# Altium project MezzanineDCDC.PrjPcb
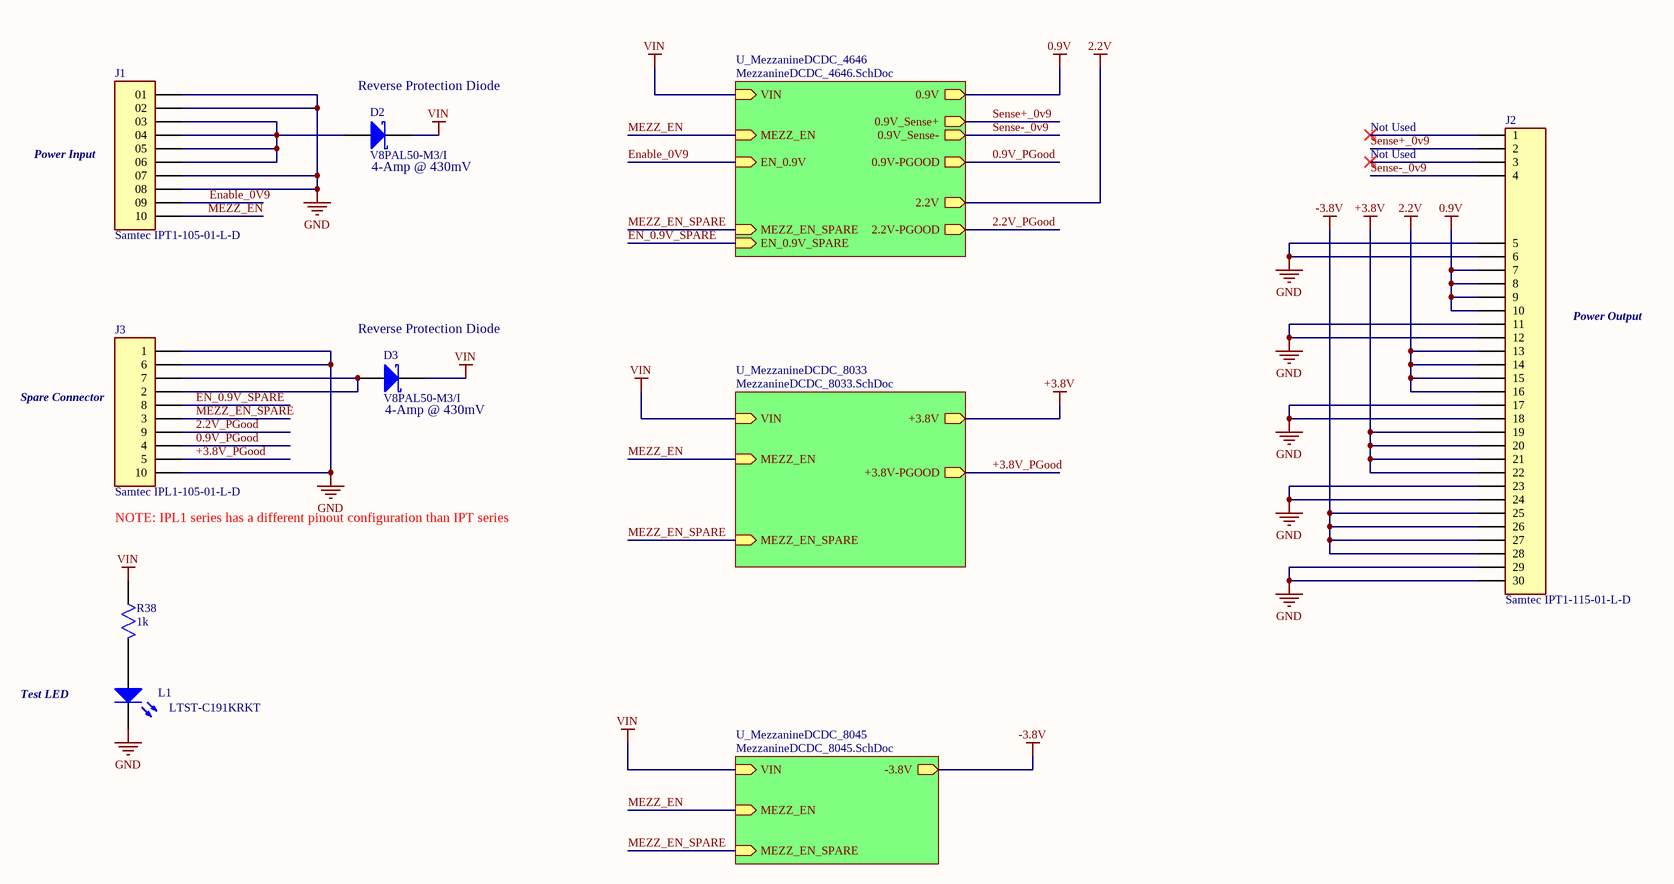
[diagram p0: MezzanineDCDC_Overall.SchDoc]
4 sheets, 95 parts. Net scope: hierarchical (ports join the sheet entries above them; power ports are global).
Board file: MezzanineDCDC_R1.PcbDoc
Sheets:
  MezzanineDCDC_Overall.SchDoc
    U_MezzanineDCDC_8033 = MezzanineDCDC_8033.SchDoc
    U_MezzanineDCDC_8045 = MezzanineDCDC_8045.SchDoc
    U_MezzanineDCDC_4646 = MezzanineDCDC_4646.SchDoc

## Sheet MezzanineDCDC_Overall.SchDoc: Mezzanine DCDC PCB Overall
size B; Date: 9/7/2021; Engineer: J. Juneau; DocumentNumber: 1006; Revision: 1.2; SheetNumber: 1; SheetTotal: 4

### Parts
D2  V8PAL50-M3/I  [Schottky Diode V8PAL50-M3/I]
D3  V8PAL50-M3/I  [Schottky Diode V8PAL50-M3/I]
J1  Samtec IPT1-105-01-L-D  [SAMTEC_IPT1-105-01-L-D]
J2  Samtec IPT1-115-01-L-D  [IPT1-115-01-L-D]
J3  Samtec IPL1-105-01-L-D  [IPL1-105-01-L-D]
L1  LTST-C191KRKT  [LED]
R38  value 1k  [Resistor ERJ2G/CRCW 0402]  (hidden comment: ERJ-2GEJ102X)

### Sub-sheets
U_MezzanineDCDC_4646 = MezzanineDCDC_4646.SchDoc: 0.9V (out), VIN (in), 2.2V-PGOOD (out), 2.2V (out), MEZZ_EN (in), EN_0.9V (in), 0.9V_Sense+ (out), 0.9V-PGOOD (out), 0.9V_Sense- (out), MEZZ_EN_SPARE (in), EN_0.9V_SPARE (in)
U_MezzanineDCDC_8033 = MezzanineDCDC_8033.SchDoc: MEZZ_EN (in), VIN (in), +3.8V-PGOOD (out), +3.8V (out), MEZZ_EN_SPARE (in)
U_MezzanineDCDC_8045 = MezzanineDCDC_8045.SchDoc: -3.8V (out), VIN (in), MEZZ_EN (in), MEZZ_EN_SPARE (in)

### Nets
0.9V: J2.7 J2.8 J2.9 J2.10 ; sheet U_MezzanineDCDC_4646/0.9V
2.2V: J2.13 J2.14 J2.15 J2.16 ; sheet U_MezzanineDCDC_4646/2.2V
+3.8V: J2.19 J2.20 J2.21 J2.22 ; sheet U_MezzanineDCDC_8033/+3.8V
-3.8V: J2.25 J2.26 J2.27 J2.28 ; sheet U_MezzanineDCDC_8045/-3.8V
GND: J1.01 J1.02 J1.07 J1.08 J2.5 J2.6 J2.11 J2.12 J2.17 J2.18 J2.23 J2.24 J2.29 J2.30 J3.1 J3.6 J3.10 L1.2(K)
VIN: D2.1(K) D3.1(K) R38.1 ; sheet U_MezzanineDCDC_8033/VIN, sheet U_MezzanineDCDC_8045/VIN, sheet U_MezzanineDCDC_4646/VIN
0.9V_PGood: J3.4 ; sheet U_MezzanineDCDC_4646/0.9V-PGOOD
2.2V_PGood: J3.9 ; sheet U_MezzanineDCDC_4646/2.2V-PGOOD
+3.8V_PGood: J3.5 ; sheet U_MezzanineDCDC_8033/+3.8V-PGOOD
EN_0.9V_SPARE: J3.8 ; sheet U_MezzanineDCDC_4646/EN_0.9V_SPARE
Enable_0V9: J1.09 ; sheet U_MezzanineDCDC_4646/EN_0.9V
MEZZ_EN: J1.10 ; sheet U_MezzanineDCDC_8033/MEZZ_EN, sheet U_MezzanineDCDC_8045/MEZZ_EN, sheet U_MezzanineDCDC_4646/MEZZ_EN
MEZZ_EN_SPARE: J3.3 ; sheet U_MezzanineDCDC_8033/MEZZ_EN_SPARE, sheet U_MezzanineDCDC_8045/MEZZ_EN_SPARE, sheet U_MezzanineDCDC_4646/MEZZ_EN_SPARE
Sense+_0v9: J2.2 ; sheet U_MezzanineDCDC_4646/0.9V_Sense+
Sense-_0v9: J2.4 ; sheet U_MezzanineDCDC_4646/0.9V_Sense-
NetD2_2: D2.2(A) J1.03 J1.04 J1.05 J1.06
NetD3_2: D3.2(A) J3.2 J3.7
NetL1_1: L1.1(A) R38.2

Not connected (* = marked no-connect by the designer): J2 1* 3*

### Notes on the sheet
- (near D2) Reverse Protection Diode
- Power Input
- (near D2) 4-Amp @ 430mV
- Not Used
- Power Output
- (near D3) Reverse Protection Diode
- (near J3) Spare Connector
- (near D3) 4-Amp @ 430mV
- (near J3) NOTE: IPL1 series has a different pinout configuration than IPT series
- Test LED
- Revision Notes:
- Title
- Size:
- Date:
- B
- Engineer:
- Number:
- Revision:
- Sheet
- of
- Electronics Development Group
- LSU Physics and Astronomy
- 133 Nicholson Hall
- Baton Rouge, LA 70803
- File:

### Library data of the parts
D2 D3 = Schotkky Diode: Diode Schottky 50V 4A Surface Mount DO-221BC (SMPA); ComponentLink1Description: Digikey; ComponentLink1URL: https://www.digikey.com/en/products/detail/vishay-general-semiconductor-diodes-division/V8PAL50-M3-I/4580781
J1 = Samtec IPT1-105-01-L-D: CONN HEADER VERT 10POS 2.54MM; ComponentLink1Description: Digikey; ComponentLink1URL: https://www.digikey.com/en/products/detail/samtec-inc/IPT1-105-01-L-D/6561590
J2 = Samtec IPT1-115-01-L-D: 15x2 Pin Connector CONN HEADER VERT 30POS 2.54MM; ComponentLink1Description: Digikey; ComponentLink1URL: https://www.digikey.com/en/products/detail/samtec-inc/IPT1-115-01-L-D/6693479
J3 = Samtec IPL1-105-01-L-D: 5x2 Pin connector; ComponentLink1Description: Samtec; ComponentLink1URL: https://www.samtec.com/products/ipl1
L1 = LED: Red 631nm LED Indication - Discrete 2V 0603 (1608 Metric); ComponentLink1Description: Digikey; ComponentLink1URL: https://www.digikey.com/en/products/detail/lite-on-inc/LTST-C191KRKT/386837?s=N4IgTCBcDaIDIBUDKCC0BhAjATkwaQCU8EQBdAXyA
R38 = ERJ2G Resistor 0402: RES SMD 1K OHM 5% 1/10W 0402; ComponentLink1Description: Digikey; ComponentLink1URL: https://www.digikey.com/en/products/detail/panasonic-electronic-components/ERJ-2GEJ102X/146898?s=N4IgTCBcDaIKICUBSBaMBxOSCMAGMAGiALoC%2BQA

## Sheet MezzanineDCDC_8033.SchDoc: Mezzanine DCDC PCB - LTM8033
size B; Date: 9/7/2021; Engineer: J. Juneau; DocumentNumber: 1006; Revision: 1.2; SheetNumber: 3; SheetTotal: 4
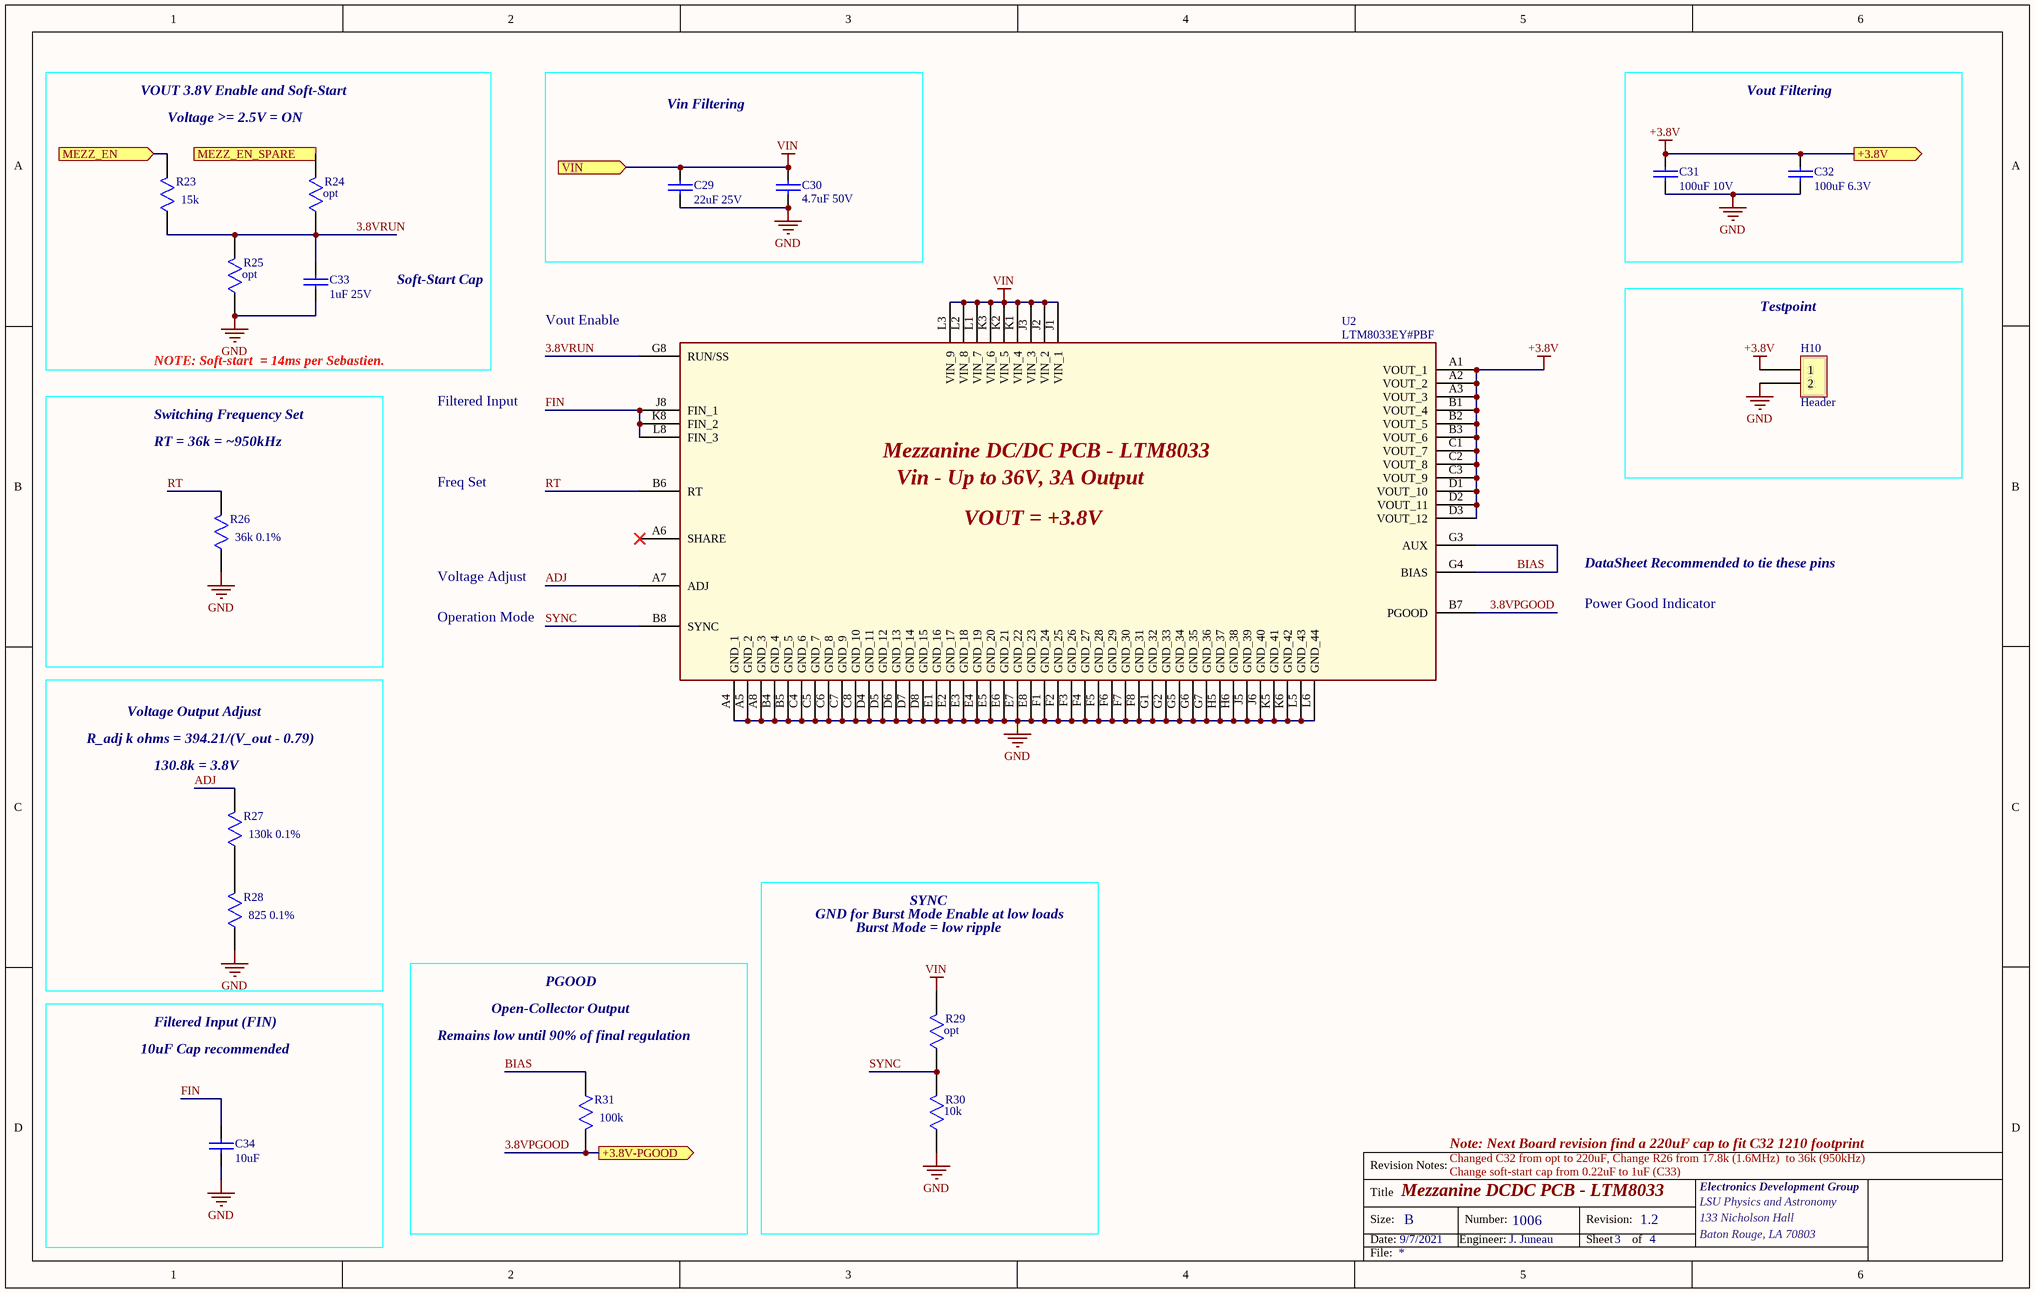
[diagram p1: MezzanineDCDC_8033.SchDoc]

### Parts
C29  value 22uF 25V  [CAP 1210 Murata]  (hidden comment: GRM32ER61E226KE15L)
C30  value 4.7uF 50V  [CAP 1206 TDK]  (hidden comment: UMK316BJ475KL-T)
C31  value 100uF 10V  [CAP 1210 Murata]  (hidden comment: LMK325BJ107MM-T)
C32  value 100uF 6.3V  [CAP 1210 Murata]  (hidden comment: GRM31CR60J227ME11L)
C33  value 1uF 25V  [Cap 0603 TDK]  (hidden comment: 06033C105KAT4A)
C34  value 10uF  [CAP 1210 Murata]  (hidden comment: GRM32ER71H106KA12L)
H10  Header  [Header 2Pin]
R23  value 15k  [Resistor ERJ2G/CRCW 0402]  (hidden comment: ERJ-U02F1502X)
R24  opt  [Resistor ERJ2G/CRCW 0402]
R25  opt  [Resistor ERJ2G/CRCW 0402]
R26  value 36k 0.1%  [Resistor 0603 - ERJ]  (hidden comment: ERA-3APB363V)
R27  value 130k 0.1%  [Resistor 0603 - ERJ]  (hidden comment: ERA-3AEB134V)
R28  value 825 0.1%  [Resistor 0603 - ERJ]  (hidden comment: ERA-3AEB8250V)
R29  opt  [Resistor ERJ2G/CRCW 0402]
R30  value 10k  [Resistor ERJ2G/CRCW 0402]  (hidden comment: ERJ-2GEJ103X)
R31  value 100k  [Resistor ERJ2G/CRCW 0402]  (hidden comment: ERJ-2RKF1003X)
U2  LTM8033EY#PBF  [LTM8033 BGA]

### Blocks framed on the sheet
Vin Filtering: C29 C30
Vout Filtering: C31 C32
Testpoint: H10

### Ports
+3.8V (out), +3.8V-PGOOD (out), MEZZ_EN (in), MEZZ_EN_SPARE (in), VIN (in)

### Nets
+3.8V: C31.1 C32.1 H10.1 U2.A1(VOUT_1) U2.A2(VOUT_2) U2.A3(VOUT_3) U2.B1(VOUT_4) U2.B2(VOUT_5) U2.B3(VOUT_6) U2.C1(VOUT_7) U2.C2(VOUT_8) U2.C3(VOUT_9) U2.D1(VOUT_10) U2.D2(VOUT_11) U2.D3(VOUT_12) ; port +3.8V
GND: C29.2 C30.2 C31.2 C32.2 C33.2 C34.2 H10.2 R25.1 R26.1 R28.1 R30.1 U2.A4(GND_1) U2.A5(GND_2) U2.A8(GND_3) U2.B4(GND_4) U2.B5(GND_5) U2.C4(GND_6) U2.C5(GND_7) U2.C6(GND_8) U2.C7(GND_9) U2.C8(GND_10) U2.D4(GND_11) U2.D5(GND_12) U2.D6(GND_13) U2.D7(GND_14) U2.D8(GND_15) U2.E1(GND_16) U2.E2(GND_17) U2.E3(GND_18) U2.E4(GND_19) U2.E5(GND_20) U2.E6(GND_21) U2.E7(GND_22) U2.E8(GND_23) U2.F1(GND_24) U2.F2(GND_25) U2.F3(GND_26) U2.F4(GND_27) U2.F5(GND_28) U2.F6(GND_29) U2.F7(GND_30) U2.F8(GND_31) U2.G1(GND_32) U2.G2(GND_33) U2.G5(GND_34) U2.G6(GND_35) U2.G7(GND_36) U2.H5(GND_37) U2.H6(GND_38) U2.J5(GND_39) U2.J6(GND_40) U2.K5(GND_41) U2.K6(GND_42) U2.L5(GND_43) U2.L6(GND_44)
VIN: C29.1 C30.1 R29.2 U2.J1(VIN_1) U2.J2(VIN_2) U2.J3(VIN_3) U2.K1(VIN_4) U2.K2(VIN_5) U2.K3(VIN_6) U2.L1(VIN_7) U2.L2(VIN_8) U2.L3(VIN_9) ; port VIN
3.8VPGOOD: R31.2 U2.B7(PGOOD) ; port +3.8V-PGOOD  [project net +3.8V_PGood]
3.8VRUN: C33.1 R23.1 R24.1 R25.2 U2.G8(RUN/SS)
ADJ: R27.2 U2.A7(ADJ)
BIAS: R31.1 U2.G3(AUX) U2.G4(BIAS)
FIN: C34.1 U2.J8(FIN_1) U2.K8(FIN_2) U2.L8(FIN_3)
MEZZ_EN: R23.2 ; port MEZZ_EN
MEZZ_EN_SPARE: R24.2 ; port MEZZ_EN_SPARE
RT: R26.2 U2.B6(RT)
SYNC: R29.1 R30.2 U2.B8(SYNC)
NetR27_1: R27.1 R28.2

Not connected (* = marked no-connect by the designer): U2 A6(SHARE)*

### Notes on the sheet
- VOUT 3.8V Enable and Soft-Start
- Voltage >= 2.5V = ON
- Soft-Start Cap
- NOTE: Soft-start  = 14ms per Sebastien.
- Vout Enable
- Switching Frequency Set
- Filtered Input
- RT = 36k = ~950kHz
- Freq Set
- (near U2) Mezzanine DC/DC PCB - LTM8033
- (near U2) Vin - Up to 36V, 3A Output
- (near U2) VOUT = +3.8V
- DataSheet Recommended to tie these pins
- Voltage Adjust
- Operation Mode
- Power Good Indicator
- R_adj k ohms = 394.21/(V_out - 0.79)
- Voltage Output Adjust
- (near R27) 130.8k = 3.8V
- SYNC
- GND for Burst Mode Enable at low loads
- Burst Mode = low ripple
- Filtered Input (FIN)
- (near R31) Remains low until 90% of final regulation
- Open-Collector Output
- PGOOD
- 10uF Cap recommended
- Changed C32 from opt to 220uF, Change R26 from 17.8k (1.6MHz)  to 36k (950kHz)
- Note: Next Board revision find a 220uF cap to fit C32 1210 footprint
- Change soft-start cap from 0.22uF to 1uF (C33)
- Revision Notes:
- Title
- Size:
- Date:
- B
- Engineer:
- Number:
- Revision:
- Sheet
- of
- Electronics Development Group
- LSU Physics and Astronomy
- 133 Nicholson Hall
- Baton Rouge, LA 70803
- File:

### Library data of the parts
C29 = Capacitor 1210: 22µF ±10% 25V Ceramic Capacitor X5R 1210 (3225 Metric); ComponentLink1Description: Digikey; ComponentLink1URL: https://www.digikey.com/en/products/detail/murata-electronics/GRM32ER61E226KE15L/965903?s=N4IgTCBcDaIOICUCyBmMBRBA2AjOsYWA0ujgKwAyIAugL5A
C30 = Capacitor 1206: 4.7µF ±10% 50V Ceramic Capacitor X5R 1206 (3216 Metric); Dimensions: 3.2x1.6x1.8mm; ComponentLink1Description: Digikey; ComponentLink1URL: https://www.digikey.com/en/products/detail/taiyo-yuden/UMK316BJ475KL-T/1646591?s=N4IgTCBcDaIKoFkDSBmAjANgEICkAsA7AKxIAyAtACogC6AvkA
C31 = Capacitor 1210: CAP CER 100UF 10V X5R 1210; ComponentLink1Description: Digikey; ComponentLink1URL: https://www.digikey.com/en/products/detail/taiyo-yuden/LMK325BJ107MM-T/1646594?s=N4IgTCBcDaIDIFkDSBmMBWAQgKQIwAYB2BBAWgBUQBdAXyA
C32 = Capacitor 1210: 220 µF ±20% 6.3V Ceramic Capacitor X5R 1206 (3216 Metric); ComponentLink1Description: Digikey; ComponentLink1URL: https://www.digikey.com/en/products/detail/murata-electronics/GRM31CR60J227ME11L/6155740
C33 = Capacitor 0603 TDK: 1 µF ±10% 25V Ceramic Capacitor X7R 0603 (1608 Metric); ComponentLink1Description: Digikey; ComponentLink1URL: https://www.digikey.com/en/products/detail/avx-corporation/06033C105KAT4A/8107677?s=N4IgTCBcDaIAwDY4GZkGMCMcCsBrAhgC4As%2BIAugL5A
C34 = Capacitor 1210: CAP CER 10UF 50V X7R 1210; ComponentLink1Description: Digikey; ComponentLink1URL: https://www.digikey.com/en/products/detail/murata-electronics/GRM32ER71H106KA12L/2548481?s=N4IgTCBcDaIOICUCyBmMBRBB2AjACRwAYA2AaQEEcwAZEAXQF8g
H10 = Header - 2Pin: Connector Header Through Hole 2 position 0.100" (2.54mm); ComponentLink1Description: Digikey; ComponentLink1URL: https://www.digikey.com/en/products/detail/amphenol-icc-fci/68001-202HLF/2023308
R23 = ERJ2G Resistor 0402: RES 15K OHM 1% 1/10W 0402 SMD; ComponentLink1Description: Digikey; ComponentLink1URL: https://www.digikey.com/en/products/detail/panasonic-electronic-components/ERJ-U02F1502X/11630567?s=N4IgTCBcDaIKICUBSBaAqgBjAMQIwFYsANEAXQF8g
R24 R25 R29 = ERJ2G Resistor 0402: Resistor 0402; Value: opt
R26 = Resistor 0603: 36 kOhms ±0.1% 0.1W, 1/10W Chip Resistor 0603 (1608 Metric) Automotive AEC-Q200 Thin Film; ComponentLink1Description: Digikey; ComponentLink1URL: https://www.digikey.com/en/products/detail/panasonic-electronic-components/ERA-3APB363V/3070649?s=N4IgTCBcDaIKICUCCBaAzAQwA4CM0DY0A3EAXQF8g
R27 = Resistor 0603: RES SMD 130K OHM 0.1% 1/10W 0603; ComponentLink1Description: Digikey; ComponentLink1URL: https://www.digikey.com/en/products/detail/panasonic-electronic-components/ERA-3AEB134V/1465905?s=N4IgTCBcDaIKICUCCBaAzEuAhAjGgLAGogC6AvkA
R28 = Resistor 0603: RES SMD 825 OHM 0.1% 1/10W 0603; ComponentLink1Description: Digikey; ComponentLink1URL: https://www.digikey.com/en/products/detail/panasonic-electronic-components/ERA-3AEB8250V/2026741?s=N4IgTCBcDaIKICUCCBaAzEuAhAHGArAAwBqIAugL5A
R30 = ERJ2G Resistor 0402: RES SMD 10K OHM 5% 1/10W 0402; ComponentLink1Description: Digikey; ComponentLink1URL: https://www.digikey.com/en/products/detail/panasonic-electronic-components/ERJ-2GEJ103X/146735?s=N4IgTCBcDaIKICUBSBaMBxOSCMAGAzABogC6AvkA
R31 = ERJ2G Resistor 0402: RES SMD 100K OHM 1% 1/10W 0402; ComponentLink1Description: Digikey; ComponentLink1URL: https://www.digikey.com/en/products/detail/panasonic-electronic-components/ERJ-2RKF1003X/192081?s=N4IgTCBcDaIKICUBSBaMCDSAxAjABjwGYANEAXQF8g
U2 = LTM8033: Non-Isolated PoL Module DC DC Converter Output 0.8 ~ 24V - - 3A 3.6V - 36V Input; ComponentLink1Description: Digikey; ComponentLink1URL: https://www.digikey.com/en/products/detail/analog-devices-inc/LTM8033EY-PBF/4964717

## Sheet MezzanineDCDC_8045.SchDoc: Mezzanine DCDC PCB - LTM8045
size B; Date: 9/7/2021; Engineer: J. Juneau; DocumentNumber: 1006; Revision: 1.2; SheetNumber: 4; SheetTotal: 4
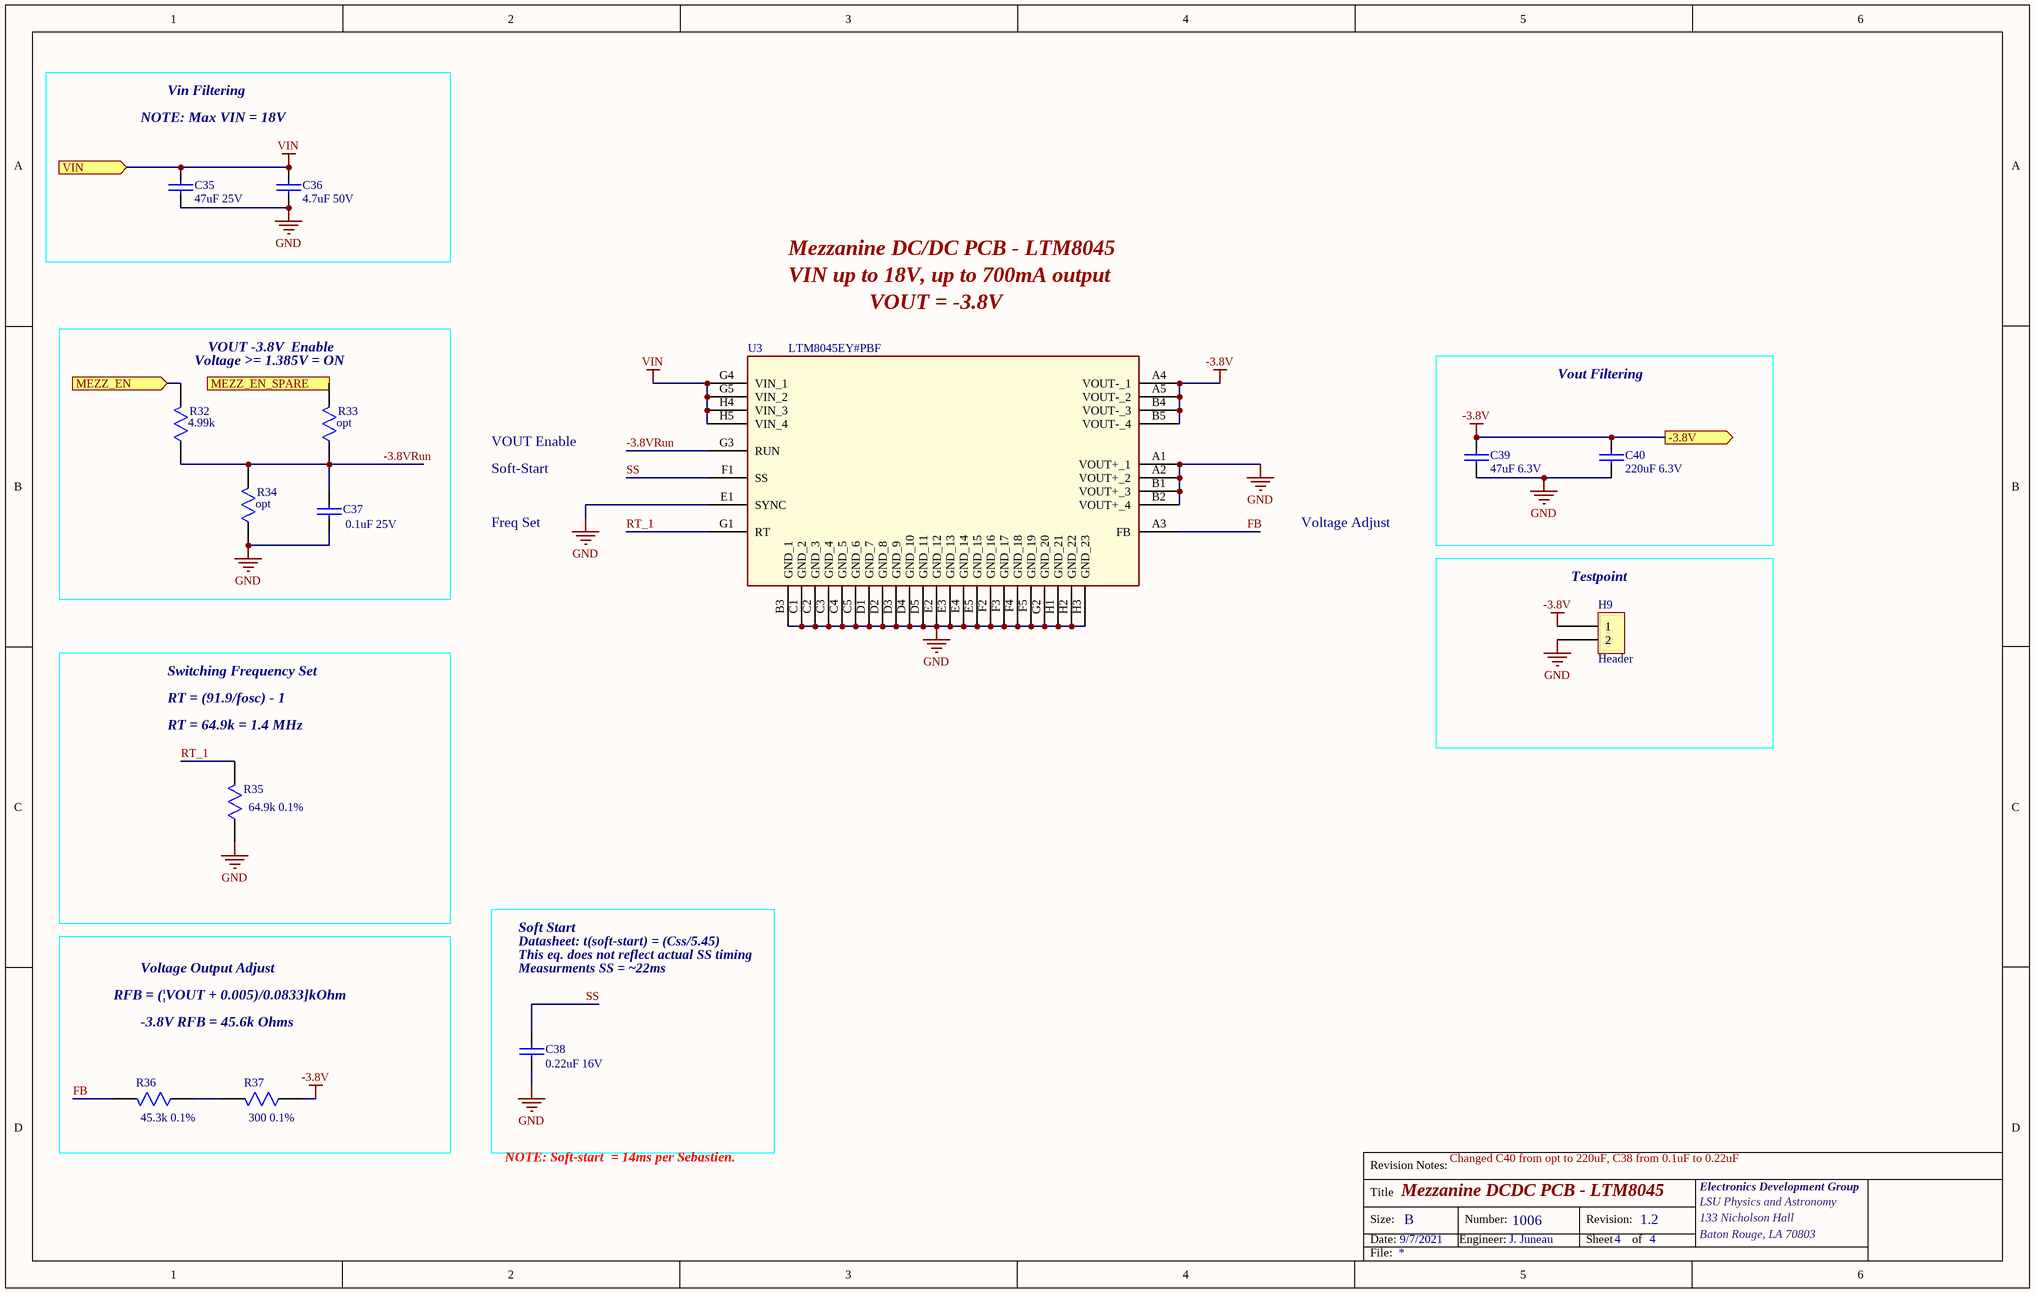
[diagram p2: MezzanineDCDC_8045.SchDoc]

### Parts
C35  value 47uF 25V  [CAP 1206 TDK]  (hidden comment: C3216X5R1E476M160AC)
C36  value 4.7uF 50V  [CAP 1206 TDK]  (hidden comment: UMK316BJ475KL-T)
C37  value 0.1uF 25V  [Cap 0603 TDK]  (hidden comment: C1608X7R1E104K080AA)
C38  value 0.22uF 16V  [Cap 0603 TDK]  (hidden comment: 0603YD224KAT2A)
C39  value 47uF 6.3V  [CAP 1206 TDK 2.3 Height]  (hidden comment: 12066D476MAT4A)
C40  value 220uF 6.3V  [CAP 1206 TDK 2.3 Height]  (hidden comment: GRM31CR60J227ME11L)
H9  Header  [Header 2Pin]
R32  value 4.99k  [Resistor ERJ2G/CRCW 0402]  (hidden comment: CRCW04024K99FKED)
R33  opt  [Resistor ERJ2G/CRCW 0402]
R34  opt  [Resistor ERJ2G/CRCW 0402]
R35  value 64.9k 0.1%  [Resistor 0603 - ERJ]  (hidden comment: ERJ-PB3B6492V)
R36  value 45.3k 0.1%  [Resistor 0603 - ERJ]  (hidden comment: ERA-3AEB4532V)
R37  value 300 0.1%  [Resistor 0603 - ERJ]  (hidden comment: ERA-3AEB301V)
U3  LTM8045EY#PBF  [LTM8045]

### Blocks framed on the sheet
Vout Filtering: C39 C40
Testpoint: H9
Soft Start: C38

### Ports
-3.8V (out), MEZZ_EN (in), MEZZ_EN_SPARE (in), VIN (in)

### Nets
-3.8V: C39.1 C40.1 H9.1 R37.1 U3.A4(VOUT-_1) U3.A5(VOUT-_2) U3.B4(VOUT-_3) U3.B5(VOUT-_4) ; port -3.8V
GND: C35.2 C36.2 C37.2 C38.2 C39.2 C40.2 H9.2 R34.1 R35.1 U3.A1(VOUT+_1) U3.A2(VOUT+_2) U3.B1(VOUT+_3) U3.B2(VOUT+_4) U3.B3(GND_1) U3.C1(GND_2) U3.C2(GND_3) U3.C3(GND_4) U3.C4(GND_5) U3.C5(GND_6) U3.D1(GND_7) U3.D2(GND_8) U3.D3(GND_9) U3.D4(GND_10) U3.D5(GND_11) U3.E1(SYNC) U3.E2(GND_12) U3.E3(GND_13) U3.E4(GND_14) U3.E5(GND_15) U3.F2(GND_16) U3.F3(GND_17) U3.F4(GND_18) U3.F5(GND_19) U3.G2(GND_20) U3.H1(GND_21) U3.H2(GND_22) U3.H3(GND_23)
VIN: C35.1 C36.1 U3.G4(VIN_1) U3.G5(VIN_2) U3.H4(VIN_3) U3.H5(VIN_4) ; port VIN
-3.8VRun: C37.1 R32.1 R33.1 R34.2 U3.G3(RUN)
FB: R36.2 U3.A3(FB)
MEZZ_EN: R32.2 ; port MEZZ_EN
MEZZ_EN_SPARE: R33.2 ; port MEZZ_EN_SPARE
RT_1: R35.2 U3.G1(RT)
SS: C38.1 U3.F1(SS)
NetR36_1: R36.1 R37.2

### Notes on the sheet
- Vin Filtering
- NOTE: Max VIN = 18V
- Mezzanine DC/DC PCB - LTM8045
- VIN up to 18V, up to 700mA output
- Voltage >= 1.385V = ON
- VOUT -3.8V  Enable
- VOUT = -3.8V
- VOUT Enable
- Soft-Start
- Freq Set
- Voltage Adjust
- Switching Frequency Set
- RT = (91.9/fosc) - 1
- (near R35) RT = 64.9k = 1.4 MHz
- Voltage Output Adjust
- Datasheet: t(soft-start) = (Css/5.45)
- This eq. does not reflect actual SS timing
- Measurments SS = ~22ms
- RFB = (|VOUT + 0.005)/0.0833]kOhm
- -3.8V RFB = 45.6k Ohms
- NOTE: Soft-start  = 14ms per Sebastien.
- Changed C40 from opt to 220uF, C38 from 0.1uF to 0.22uF
- Revision Notes:
- Title
- Size:
- Date:
- B
- Engineer:
- Number:
- Revision:
- Sheet
- of
- Electronics Development Group
- LSU Physics and Astronomy
- 133 Nicholson Hall
- Baton Rouge, LA 70803
- File:

### Library data of the parts
C35 = Capacitor 1206: 47µF ±20% 25V Ceramic Capacitor X5R 1206 (3216 Metric); Dimensions: 3.2x1.6x1.8mm; ComponentLink1Description: Digikey; ComponentLink1URL: https://www.digikey.com/en/products/detail/taiyo-yuden/UMK316BJ475KL-T/1646591?s=N4IgTCBcDaIKoFkDSBmAjANgEICkAsA7AKxIAyAtACogC6AvkA
C36 = Capacitor 1206: as C30 on sheet MezzanineDCDC_8033; Dimensions: 3.2x1.6x1.8mm; ComponentLink1Description: Digikey; ComponentLink1URL: https://www.digikey.com/en/products/detail/taiyo-yuden/UMK316BJ475KL-T/1646591?s=N4IgTCBcDaIKoFkDSBmAjANgEICkAsA7AKxIAyAtACogC6AvkA
C37 = Capacitor 0603 TDK: CAP CER 0.1UF 25V X7R 0603; ComponentLink1Description: Digikey; ComponentLink1URL: https://www.digikey.com/en/products/detail/tdk-corporation/C1608X7R1E104K080AA/513803?s=N4IgTCBcDaIMIEYBsAGAHADQOwCUEFEEUAWAaXRQEFKACEAXQF8g
C38 = Capacitor 0603 TDK: 0.22 µF ±10% 16V Ceramic Capacitor X5R 0603 (1608 Metric); ComponentLink1Description: Digikey
C39 = Capacitor 1206 2.3mmHeight: 47µF ±20% 6.3V Ceramic Capacitor X5R 1206 (3216 Metric); Dimensions: 3.2x1.6x2.3mm; ComponentLink1Description: Digikey; ComponentLink1URL: https://www.digikey.com/en/products/detail/avx-corporation/12066D476MAT4A/8107694?s=N4IgTCBcDaIIxgAwDZkBEAsB2ZBZAggCob4gC6AvkA
C40 = Capacitor 1206 2.3mmHeight: 220 µF ±20% 6.3V Ceramic Capacitor X5R 1206 (3216 Metric); ComponentLink1Description: Digikey; ComponentLink1URL: https://www.digikey.com/en/products/detail/murata-electronics/GRM31CR60J227ME11L/6155740*
H9 = Header - 2Pin: as H10 on sheet MezzanineDCDC_8033; ComponentLink1Description: Digikey; ComponentLink1URL: https://www.digikey.com/en/products/detail/amphenol-icc-fci/68001-202HLF/2023308
R32 = ERJ2G Resistor 0402: RES, Thick Film, 4.99 kOhm, 1.0 %, 1/16 W, SMD, 0402; ComponentLink1Description: Digikey; ComponentLink1URL: https://www.digikey.com/en/products/detail/vishay-dale/CRCW04024K99FKED/1178086
R33 R34 = ERJ2G Resistor 0402: Resistor 0402; Value: opt
R35 = Resistor 0603: 64.9 ±0.1% 0.2W, 1/5W Chip Resistor 0603 (1608 Metric) Automotive AEC-Q200, Pulse Withstanding Thick Film; ComponentLink1Description: Digikey; ComponentLink1URL: https://www.digikey.com/en/products/detail/panasonic-electronic-components/ERJ-PB3B6492V/6212962
R36 = Resistor 0603: RES SMD 45.3KOHM 0.1% 1/10W 0603; ComponentLink1Description: Digikey; ComponentLink1URL: https://www.digikey.com/en/products/detail/panasonic-electronic-components/ERA-3AEB4532V/2026897?s=N4IgTCBcDaIKICUCCBaAzEuAhALAVjTADUQBdAXyA
R37 = Resistor 0603: RES SMD 300 OHM 0.1% 1/10W 0603; ComponentLink1Description: Digikey; ComponentLink1URL: https://www.digikey.com/en/products/detail/panasonic-electronic-components/ERA-3AEB301V/1465841?s=N4IgTCBcDaIKICUCCBaAzEuAhNAGAjAGogC6AvkA
U3 = LTM8045: Non-Isolated PoL Module DC DC Converter Output -2.5 ~ -15V, 2.5 ~ 15V - - 700mA 2.8V - 18V Input; ComponentLink1Description: Digikey; ComponentLink1URL: https://www.digikey.com/en/products/detail/analog-devices-inc/LTM8045IY-PBF/3883289

## Sheet MezzanineDCDC_4646.SchDoc: Mezzanine DCDC PCB LTM4646
size Tabloid; Date: 9/7/2021; Engineer: J. Juneau; Organization: Altium Limited; Address1: L3, 12a Rodborough Rd; Address2: Frenchs Forest; Address3: NSW; Address4: Australia 2086; DocumentNumber: 1006; Revision: 1.2; SheetNumber: 2; SheetTotal: 4
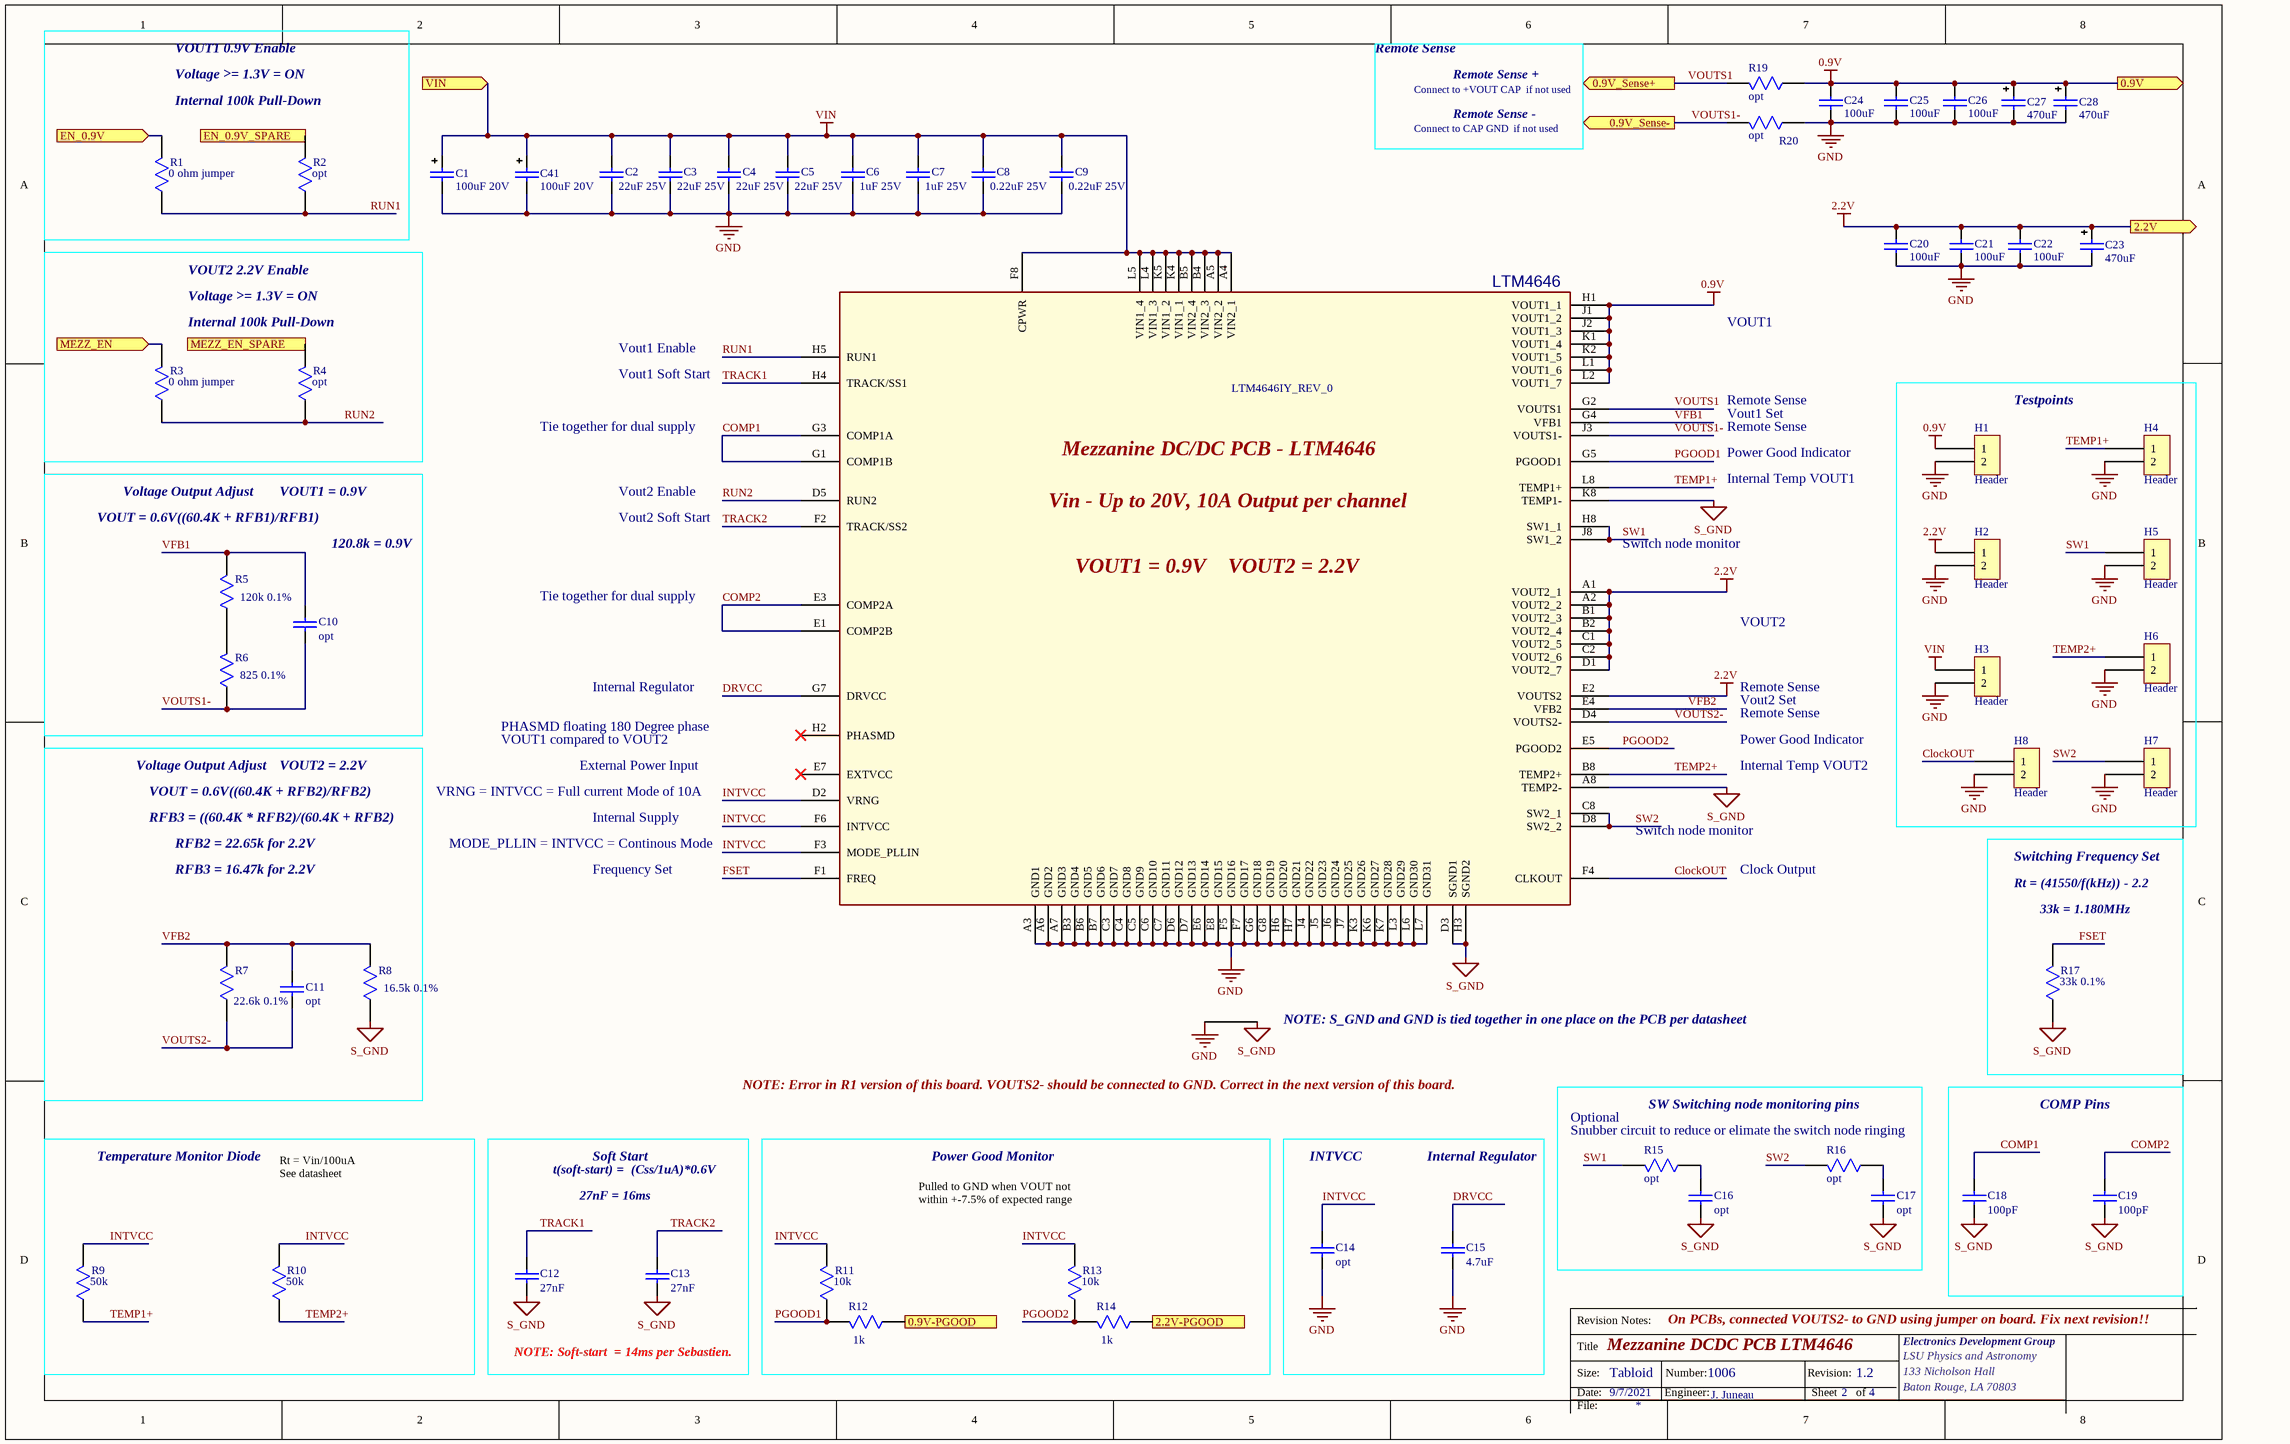
[diagram p3: MezzanineDCDC_4646.SchDoc]

### Parts
C1  value 100uF 20V  [CAP 2917 Tantalum Polarized TAJE107K020RNJ]  (hidden comment: TAJE107K020RNJ)
C2  value 22uF 25V  [CAP 1210 Murata]  (hidden comment: GRM32ER61E226KE15L)
C3  value 22uF 25V  [CAP 1210 Murata]  (hidden comment: GRM32ER61E226KE15L)
C4  value 22uF 25V  [CAP 1210 Murata]  (hidden comment: GRM32ER61E226KE15L)
C5  value 22uF 25V  [CAP 1210 Murata]  (hidden comment: GRM32ER61E226KE15L)
C6  value 1uF 25V  [Cap 0603 TDK]  (hidden comment: GCM188R71E105KA64D)
C7  value 1uF 25V  [Cap 0603 TDK]  (hidden comment: GCM188R71E105KA64D)
C8  value 0.22uF 25V  [Cap 0603 TDK]  (hidden comment: C1608X7R1E224K080AC)
C9  value 0.22uF 25V  [Cap 0603 TDK]  (hidden comment: C1608X7R1E224K080AC)
C10  opt  [Cap 0603 TDK]
C11  opt  [Cap 0603 TDK]
C12  value 27nF  [Cap 0603 TDK]  (hidden comment: 0603YC273KAT2A)
C13  value 27nF  [Cap 0603 TDK]  (hidden comment: 0603YC273KAT2A)
C14  value opt  [Cap 0603 TDK]  (hidden comment: C1608X5R1C475K080AC)
C15  value 4.7uF  [Cap 0603 TDK]  (hidden comment: C1608X5R1C475K080AC)
C16  opt  [Cap 0603 TDK]
C17  opt  [Cap 0603 TDK]
C18  value 100pF  [Cap 0603 TDK]  (hidden comment: 0603YC101KAT2A)
C19  value 100pF  [Cap 0603 TDK]  (hidden comment: 0603YC101KAT2A)
C20  value 100uF  [CAP 1210 Murata]  (hidden comment: GRM32ER60J107ME20K)
C21  value 100uF  [CAP 1210 Murata]  (hidden comment: GRM32ER60J107ME20K)
C22  value 100uF  [CAP 1210 Murata]  (hidden comment: GRM32ER60J107ME20K)
C23  value 470uF  [CAP 2917 Tantalum Polarized]  (hidden comment: 4TPE470MCL)
C24  value 100uF  [CAP 1210 Murata]  (hidden comment: GRM32ER60J107ME20K)
C25  value 100uF  [CAP 1210 Murata]  (hidden comment: GRM32ER60J107ME20K)
C26  value 100uF  [CAP 1210 Murata]  (hidden comment: GRM32ER60J107ME20K)
C27  value 470uF  [CAP 2917 Tantalum Polarized]  (hidden comment: 4TPE470MCL)
C28  value 470uF  [CAP 2917 Tantalum Polarized]  (hidden comment: 4TPE470MCL)
C41  value 100uF 20V  [CAP 2917 Tantalum Polarized TAJE107K020RNJ]  (hidden comment: TAJE107K020RNJ)
H1  Header  [Header 2Pin]
H2  Header  [Header 2Pin]
H3  Header  [Header 2Pin]
H4  Header  [Header 2Pin]
H5  Header  [Header 2Pin]
H6  Header  [Header 2Pin]
H7  Header  [Header 2Pin]
H8  Header  [Header 2Pin]
R1  value 0 ohm jumper  [Resistor ERJ2G/CRCW 0402]  (hidden comment: CRCW04020000ZSTD)
R2  opt  [Resistor ERJ2G/CRCW 0402]
R3  value 0 ohm jumper  [Resistor ERJ2G/CRCW 0402]  (hidden comment: CRCW04020000ZSTD)
R4  opt  [Resistor ERJ2G/CRCW 0402]
R5  value 120k 0.1%  [Resistor 0603 - ERJ]  (hidden comment: ERA-3AEB124V)
R6  value 825 0.1%  [Resistor 0603 - ERJ]  (hidden comment: ERA-3AEB8250V)
R7  value 22.6k 0.1%  [Resistor 0603 - ERJ]  (hidden comment: ERA-3AEB2262V)
R8  value 16.5k 0.1%  [Resistor 0603 - ERJ]  (hidden comment: ERA-3AEB1652V)
R9  value 50k  [Resistor ERJ2G/CRCW 0402]  (hidden comment: ERA-2AEB4992X)
R10  value 50k  [Resistor ERJ2G/CRCW 0402]  (hidden comment: ERA-2AEB4992X)
R11  value 10k  [Resistor ERJ2G/CRCW 0402]  (hidden comment: ERJ-2GEJ103X)
R12  value 1k  [Resistor ERJ2G/CRCW 0402]  (hidden comment: ERJ-2GEJ102X)
R13  value 10k  [Resistor ERJ2G/CRCW 0402]  (hidden comment: ERJ-2GEJ103X)
R14  value 1k  [Resistor ERJ2G/CRCW 0402]  (hidden comment: ERJ-2GEJ102X)
R15  opt  [Resistor ERJ2G/CRCW 0402]
R16  opt  [Resistor ERJ2G/CRCW 0402]
R17  value 33k 0.1%  [Resistor 0603 - ERJ]  (hidden comment: ERA-3AEB333V)
R19  opt  [Resistor ERJ2G/CRCW 0402]
R20  opt  [Resistor ERJ2G/CRCW 0402]
U1  LTM4646IY_REV_0  [LTM4646]  (net tie, no BOM)

### Blocks framed on the sheet
Testpoints: H1-H8
Switching Frequency Set: R17
COMP Pins: C18 C19
Temperature Monitor Diode: R9 R10
Soft Start: C12 C13
Power Good Monitor: R11-R14

### Ports
0.9V (out), 0.9V-PGOOD (out), 0.9V_Sense+ (out), 0.9V_Sense- (out), 2.2V (out), 2.2V-PGOOD (out), EN_0.9V (in), EN_0.9V_SPARE (in), MEZZ_EN (in), MEZZ_EN_SPARE (in), VIN (in)

### Nets
0.9V: C24.1 C25.1 C26.1 C27.1 C28.1 H1.1 R19.1 U1.H1(VOUT1_1) U1.J1(VOUT1_2) U1.J2(VOUT1_3) U1.K1(VOUT1_4) U1.K2(VOUT1_5) U1.L1(VOUT1_6) U1.L2(VOUT1_7) ; port 0.9V
2.2V: C20.1 C21.1 C22.1 C23.1 H2.1 U1.A1(VOUT2_1) U1.A2(VOUT2_2) U1.B1(VOUT2_3) U1.B2(VOUT2_4) U1.C1(VOUT2_5) U1.C2(VOUT2_6) U1.D1(VOUT2_7) U1.E2(VOUTS2) ; port 2.2V
GND: C1.2 C2.2 C3.2 C4.2 C5.2 C6.2 C7.2 C8.2 C9.2 C14.2 C15.2 C20.2 C21.2 C22.2 C23.2 C24.2 C25.2 C26.2 C27.2 C28.2 C41.2 H1.2 H2.2 H3.2 H4.2 H5.2 H6.2 H7.2 H8.2 R20.1 U1.A3(GND1) U1.A6(GND2) U1.A7(GND3) U1.B3(GND4) U1.B6(GND5) U1.B7(GND6) U1.C3(GND7) U1.C4(GND8) U1.C5(GND9) U1.C6(GND10) U1.C7(GND11) U1.D6(GND12) U1.D7(GND13) U1.E6(GND14) U1.E8(GND15) U1.F5(GND16) U1.F7(GND17) U1.G6(GND18) U1.G8(GND19) U1.H6(GND20) U1.H7(GND21) U1.J4(GND22) U1.J5(GND23) U1.J6(GND24) U1.J7(GND25) U1.K3(GND26) U1.K6(GND27) U1.K7(GND28) U1.L3(GND29) U1.L6(GND30) U1.L7(GND31)
S_GND: C12.2 C13.2 C16.2 C17.2 C18.2 C19.2 R8.1 R17.1 U1.A8(TEMP2-) U1.D3(SGND1) U1.H3(SGND2) U1.K8(TEMP1-)
VIN: C1.1 C2.1 C3.1 C4.1 C5.1 C6.1 C7.1 C8.1 C9.1 C41.1 H3.1 U1.A4(VIN2_1) U1.A5(VIN2_2) U1.B4(VIN2_3) U1.B5(VIN2_4) U1.F8(CPWR) U1.K4(VIN1_1) U1.K5(VIN1_2) U1.L4(VIN1_3) U1.L5(VIN1_4) ; port VIN
0.9V_PGood: R12.1 ; port 0.9V-PGOOD
2.2V_PGood: R14.1 ; port 2.2V-PGOOD
ClockOUT: H8.1 U1.F4(CLKOUT)
COMP1: C18.1 U1.G1(COMP1B) U1.G3(COMP1A)
COMP2: C19.1 U1.E1(COMP2B) U1.E3(COMP2A)
DRVCC: C15.1 U1.G7(DRVCC)
EN_0.9V_SPARE: R2.2 ; port EN_0.9V_SPARE
Enable_0V9: R1.2 ; port EN_0.9V
FSET: R17.2 U1.F1(FREQ)
INTVCC: C14.1 R9.2 R10.2 R11.2 R13.2 U1.D2(VRNG) U1.F3(MODE_PLLIN) U1.F6(INTVCC)
MEZZ_EN: R3.2 ; port MEZZ_EN
MEZZ_EN_SPARE: R4.2 ; port MEZZ_EN_SPARE
PGOOD1: R11.1 R12.2 U1.G5(PGOOD1)
PGOOD2: R13.1 R14.2 U1.E5(PGOOD2)
RUN1: R1.1 R2.1 U1.H5(RUN1)
RUN2: R3.1 R4.1 U1.D5(RUN2)
SW1: H5.1 R15.2 U1.H8(SW1_1) U1.J8(SW1_2)
SW2: H7.1 R16.2 U1.C8(SW2_1) U1.D8(SW2_2)
TEMP1+: H4.1 R9.1 U1.L8(TEMP1+)
TEMP2+: H6.1 R10.1 U1.B8(TEMP2+)
TRACK1: C12.1 U1.H4(TRACK/SS1)
TRACK2: C13.1 U1.F2(TRACK/SS2)
VFB1: C10.1 R5.2 U1.G4(VFB1)
VFB2: C11.1 R7.2 R8.2 U1.E4(VFB2)
VOUTS1: R19.2 U1.G2(VOUTS1) ; port 0.9V_Sense+  [project net Sense+_0v9]
VOUTS1-: C10.2 R6.1 R20.2 U1.J3(VOUTS1-) ; port 0.9V_Sense-  [project net Sense-_0v9]
VOUTS2-: C11.2 R7.1 U1.D4(VOUTS2-)
NetC16_1: C16.1 R15.1
NetC17_1: C17.1 R16.1
NetR5_1: R5.1 R6.2

Not connected (* = marked no-connect by the designer): U1 E7(EXTVCC)* H2(PHASMD)*

### Notes on the sheet
- VOUT1 0.9V Enable
- Voltage >= 1.3V = ON
- Remote Sense
- Connect to +VOUT CAP  if not used
- Remote Sense +
- Internal 100k Pull-Down
- Connect to CAP GND  if not used
- Remote Sense -
- VOUT2 2.2V Enable
- Vout1 Enable
- VOUT1
- Vout1 Soft Start
- Vout1 Set
- Tie together for dual supply
- (near U1) Mezzanine DC/DC PCB - LTM4646
- Internal Temp VOUT1
- Power Good Indicator
- (near R5) VOUT = 0.6V((60.4K + RFB1)/RFB1)
- Voltage Output Adjust
- VOUT1 = 0.9V
- 120.8k = 0.9V
- Vout2 Enable
- Vout2 Soft Start
- (near U1) Vin - Up to 20V, 10A Output per channel
- Switch node monitor
- (near U1) VOUT1 = 0.9V    VOUT2 = 2.2V
- VOUT2
- PHASMD floating 180 Degree phase
- VOUT1 compared to VOUT2
- Internal Regulator
- Vout2 Set
- VOUT = 0.6V((60.4K + RFB2)/RFB2)
- VOUT2 = 2.2V
- VRNG = INTVCC = Full current Mode of 10A
- External Power Input
- Internal Temp VOUT2
- RFB3 = ((60.4K * RFB2)/(60.4K + RFB2)
- RFB2 = 22.65k for 2.2V
- RFB3 = 16.47k for 2.2V
- MODE_PLLIN = INTVCC = Continous Mode
- Internal Supply
- Frequency Set
- Clock Output
- Rt = (41550/f(kHz)) - 2.2
- (near R17) 33k = 1.180MHz
- NOTE: S_GND and GND is tied together in one place on the PCB per datasheet
- NOTE: Error in R1 version of this board. VOUTS2- should be connected to GND. Correct in the next version of this board.
- Snubber circuit to reduce or elimate the switch node ringing
- (near R15) Optional
- SW Switching node monitoring pins
- Rt = Vin/100uA
  See datasheet
- t(soft-start) =  (Css/1uA)*0.6V
- 27nF = 16ms
- Pulled to GND when VOUT not within +-7.5% of expected range
- INTVCC
- On PCBs, connected VOUTS2- to GND using jumper on board. Fix next revision!!
- NOTE: Soft-start  = 14ms per Sebastien.
- Labels drawn without touching a wire or pin: GND, S_GND
- Revision Notes:
- Title
- Size:
- Date:
- Tabloid
- Engineer:
- Number:
- Revision:
- Sheet
- of
- Electronics Development Group
- LSU Physics and Astronomy
- 133 Nicholson Hall
- Baton Rouge, LA 70803
- File:
- (in symbol LTM4646IY 05-11-0399) LTM4646

### Library data of the parts
C1 C41 = Capacitor 2917 TAJE107K020RNJ: 100µF Molded Tantalum Capacitors 20V 2917 (7343 Metric) 400mOhm; ComponentLink1Description: Digikey; ComponentLink1URL: https://www.digikey.com/en/products/detail/avx-corporation/TAJE107K020RNJ/563850
C2-C5 = Capacitor 1210: as C29 on sheet MezzanineDCDC_8033; ComponentLink1Description: Digikey; ComponentLink1URL: https://www.digikey.com/en/products/detail/murata-electronics/GRM32ER61E226KE15L/965903?s=N4IgTCBcDaIOICUCyBmMBRBA2AjOsYWA0ujgKwAyIAugL5A
C6 C7 = Capacitor 0603 TDK: 1µF ±10% 25V Ceramic Capacitor X7R 0603 (1608 Metric); ComponentLink1Description: Digikey; ComponentLink1URL: https://www.digikey.com/en/products/detail/murata-electronics/GCM188R71E105KA64D/4903956?s=N4IgTCBcDaIOIGECyBGAHGgSgdhQURQAYBWAaQEEA2AFgBEQBdAXyA
C8 C9 = Capacitor 0603 TDK: CAP CER 0.22UF 25V X7R 0603; ComponentLink1Description: Digikey; ComponentLink1URL: https://www.digikey.com/en/products/detail/tdk-corporation/C1608X7R1E224K080AC/1788457?s=N4IgTCBcDaIMIEYBsAGAHADQOwCUEFEwwAWAaXRQEE4QBdAXyA
C10 C11 C16 C17 = Capacitor 0603 TDK: Capacitor 0603; Value: opt
C12 C13 = Capacitor 0603 TDK: 0.027µF ±10% 16V Ceramic Capacitor X7R 0603 (1608 Metric) /; ComponentLink1Description: Digikey; ComponentLink1URL: https://www.digikey.com/en/products/detail/avx-corporation/0603YC273KAT2A/1600569
  C13: Dimensions: *
C14 C15 = Capacitor 0603 TDK: CAP CER 4.7UF 16V X5R 0603; ComponentLink1Description: Digikey; ComponentLink1URL: https://www.digikey.com/en/products/detail/tdk-corporation/C1608X5R1C475K080AC/2732913?s=N4IgTCBcDaIMIEYBsAGAHADQKwCUFwBYB2LAaXRQEE4QBdAXyA
C18 C19 = Capacitor 0603 TDK: 100pF ±10% 16V Ceramic Capacitor X7R 0603 (1608 Metric) /; ComponentLink1Description: Digikey; ComponentLink1URL: https://www.digikey.com/en/products/detail/avx-corporation/0603YC101KAT2A/1600476
  C18: Dimensions: 1.6x0.81x0.9mm
C20-C22 C24-C26 = Capacitor 1210: 100µF ±20% 6.3V Ceramic Capacitor X5R 1210 (3225 Metric); Dimensions: 3.2x2.5x2.7mm; ComponentLink1Description: Digikey; ComponentLink1URL: https://www.digikey.com/en/products/detail/murata-electronics/GRM32ER60J107ME20K/2548458?s=N4IgTCBcDaIOICUCyBmMBRBA2ADAKQEYcB2JdMHAaRAF0BfIA
C23 C27 C28 = Capacitor 2917 Panasonic: 470µF Molded Tantalum Polymer Capacitor 4V 2917 (7343 Metric) 12mOhm @ 100kHz; ComponentLink1Description: Digikey; ComponentLink1URL: https://www.digikey.com/en/products/detail/panasonic-electronic-components/4TPE470MCL/4146614?s=N4IgTCBcDaICwBUAKBROB2ADAWQMIBkQBdAXyA
H1-H8 = Header - 2Pin: as H10 on sheet MezzanineDCDC_8033; ComponentLink1Description: Digikey; ComponentLink1URL: https://www.digikey.com/en/products/detail/amphenol-icc-fci/68001-202HLF/2023308
R1 R3 = ERJ2G Resistor 0402: Jumper 0.063W, 1/16W Chip Resistor 0402 (1005 Metric) Automotive AEC-Q200 Thick Film; ComponentLink1Description: Digikey; ComponentLink1URL: https://www.digikey.com/en/products/detail/vishay-dale/CRCW04020000ZSTD/1226552
R2 R4 R15 R16 R19 R20 = ERJ2G Resistor 0402: Resistor 0402; Value: opt
R5 = Resistor 0603: 120 kOhms ±0.1% 0.1W, 1/10W Chip Resistor 0603 (1608 Metric) Automotive AEC-Q200 Thin Film; ComponentLink1Description: Digikey; ComponentLink1URL: https://www.digikey.com/en/products/detail/panasonic-electronic-components/ERA-3AEB124V/1465904
R6 = Resistor 0603: RES SMD 825 OHM 0.1% 1/10W 0603; ComponentLink1Description: Digikey; ComponentLink1URL: https://www.digikey.com/en/products/detail/panasonic-electronic-components/ERA-3AEB8250V/2026741?s=N4IgTCBcDaIKICUCCBaAzEuAhAHGArAAwBqIAugL5A
R7 = Resistor 0603: 22.6 kOhms ±0.1% 0.1W, 1/10W Chip Resistor 0603 (1608 Metric) Automotive AEC-Q200 Thin Film; ComponentLink1Description: Digikey; ComponentLink1URL: https://www.digikey.com/en/products/detail/panasonic-electronic-components/ERA-3AEB2262V/2026868?s=N4IgjCBcoMxaBjKAzAhgGwM4FMA0IB7KAbRAHYYIBdfABwBcoQBlegJwEsA7AcxAF98YAGzwQSSGix5CJEDACcAJgAsomiAZNWnXgKEKAHArESpOfEUikADCA1bILdtz6CQSm4YCsplBgtZaw8lADphAAIAawB5AAsAW0x7OkYnAFUuDnoY5ABZbFRMAFc2bH0QAFolP0h2YpkrUl8HNJAKypVa80a5MENhBRbUpgF%2BfiA
R8 = Resistor 0603: 16.5 kOhms ±0.1% 0.1W, 1/10W Chip Resistor 0603 (1608 Metric) Automotive AEC-Q200 Thin Film; ComponentLink1Description: Digikey; ComponentLink1URL: https://www.digikey.com/en/products/detail/panasonic-electronic-components/ERA-3AEB1652V/2026856
R9 R10 = ERJ2G Resistor 0402: 49.9 ±0.1% 0.063W, 1/16W Chip Resistor 0402 (1005 Metric) Automotive AEC-Q200 Thin Film; ComponentLink1Description: Digikey; ComponentLink1URL: https://www.digikey.com/en/products/detail/panasonic-electronic-components/ERA-2AEB4992X/2026206?s=N4IgjCBcoMxaBjKAzAhgGwM4FMA0IB7KAbRAHYYIBdfABwBcoQBlegJwEsA7AcxAF98YAGzwQSSGix5CJEDACcYAKwAOEDRAMmrTrwH4ATAAZVysRKk58RSKQAsCgHQKABAGsA8gAsAtpg06RkgQAFUuDnpPZABZbFRMAFc2bAMQAFpDCyh2RJlbUnNNbRC09PtsyQxrWTtwVWEFCuLgkAF%2BfiA
R11 R13 = ERJ2G Resistor 0402: RES SMD 10K OHM 5% 1/10W 0402; ComponentLink1Description: Digikey; ComponentLink1URL: https://www.digikey.com/en/products/detail/panasonic-electronic-components/ERJ-2GEJ103X/146735?s=N4IgTCBcDaIKICUBSBaMBxOSCMAGAzABogC6AvkA
R12 R14 = ERJ2G Resistor 0402: RES SMD 1K OHM 5% 1/10W 0402; ComponentLink1Description: Digikey; ComponentLink1URL: https://www.digikey.com/en/products/detail/panasonic-electronic-components/ERJ-2GEJ102X/146898?s=N4IgTCBcDaIKICUBSBaMBxOSCMAGMAGiALoC%2BQA
R17 = Resistor 0603: 33 ±0.1% 0.1W, 1/10W Chip Resistor 0603 (1608 Metric) Automotive AEC-Q200 Thin Film; ComponentLink1Description: Digikey; ComponentLink1URL: https://www.digikey.com/en/products/detail/panasonic-electronic-components/ERA-3AEB333V/1465890
U1 = LTM4646IY 05-11-0399

## Nets that join several sheets
0.9V: MezzanineDCDC_Overall (J2.7 J2.8 J2.9 J2.10), MezzanineDCDC_4646 (14 pins)
2.2V: MezzanineDCDC_Overall (J2.13 J2.14 J2.15 J2.16), MezzanineDCDC_4646 (13 pins)
+3.8V: MezzanineDCDC_Overall (J2.19 J2.20 J2.21 J2.22), MezzanineDCDC_8033 (15 pins)
-3.8V: MezzanineDCDC_Overall (J2.25 J2.26 J2.27 J2.28), MezzanineDCDC_8045 (8 pins)
GND: MezzanineDCDC_Overall (18 pins), MezzanineDCDC_8033 (55 pins), MezzanineDCDC_8045 (37 pins), MezzanineDCDC_4646 (61 pins)
VIN: MezzanineDCDC_Overall (D2.1 D3.1 R38.1), MezzanineDCDC_8033 (12 pins), MezzanineDCDC_8045 (6 pins), MezzanineDCDC_4646 (20 pins)
0.9V_PGood: MezzanineDCDC_Overall (J3.4), MezzanineDCDC_4646 (R12.1)
2.2V_PGood: MezzanineDCDC_Overall (J3.9), MezzanineDCDC_4646 (R14.1)
+3.8V_PGood: MezzanineDCDC_Overall (J3.5), MezzanineDCDC_8033 (R31.2 U2.B7)
EN_0.9V_SPARE: MezzanineDCDC_Overall (J3.8), MezzanineDCDC_4646 (R2.2)
Enable_0V9: MezzanineDCDC_Overall (J1.09), MezzanineDCDC_4646 (R1.2)
MEZZ_EN: MezzanineDCDC_Overall (J1.10), MezzanineDCDC_8033 (R23.2), MezzanineDCDC_8045 (R32.2), MezzanineDCDC_4646 (R3.2)
MEZZ_EN_SPARE: MezzanineDCDC_Overall (J3.3), MezzanineDCDC_8033 (R24.2), MezzanineDCDC_8045 (R33.2), MezzanineDCDC_4646 (R4.2)
Sense+_0v9: MezzanineDCDC_Overall (J2.2), MezzanineDCDC_4646 (R19.2 U1.G2)
Sense-_0v9: MezzanineDCDC_Overall (J2.4), MezzanineDCDC_4646 (C10.2 R6.1 R20.2 U1.J3)